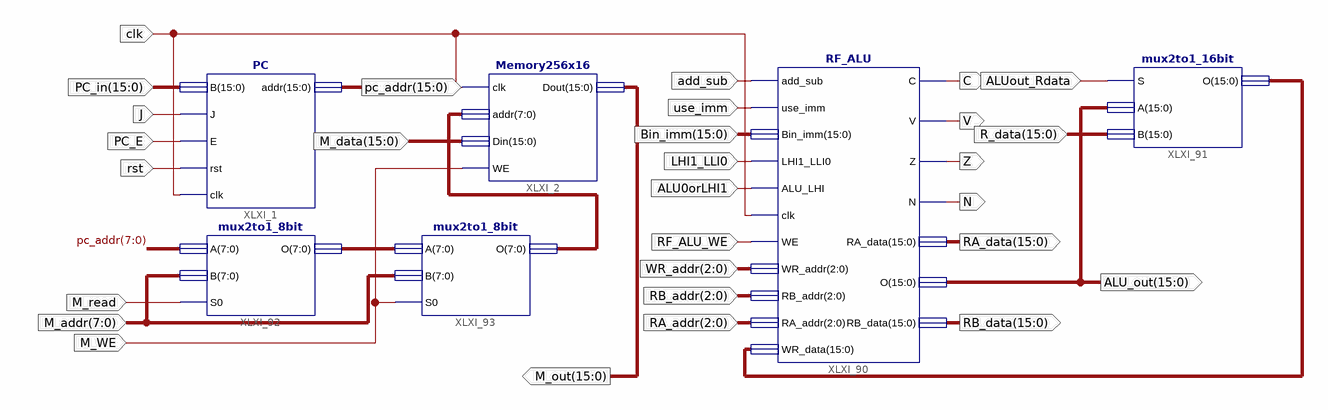
[diagram p0: schematic sheet 1]
// Xilinx ISE schematic datapath.sch (spartan6) as structural Verilog: 6 symbols, 29 ports
module datapath (
  input  J,
  input  PC_E,
  input  rst,
  input  [15:0] PC_in,
  input  RF_ALU_WE,
  input  [15:0] M_data,
  input  [15:0] Bin_imm,
  input  use_imm,
  input  add_sub,
  input  LHI1_LLI0,
  input  ALU0orLHI1,
  input  [2:0] WR_addr,
  input  [2:0] RB_addr,
  input  [2:0] RA_addr,
  input  clk,
  input  [7:0] M_addr,
  input  M_WE,
  input  M_read,
  input  [15:0] R_data,
  input  ALUout_Rdata,
  output C,
  output V,
  output Z,
  output N,
  output [15:0] pc_addr,
  output [15:0] M_out,
  output [15:0] ALU_out,
  output [15:0] RB_data,
  output [15:0] RA_data
);

  wire [7:0] XLXN_121, XLXN_218;
  wire [15:0] XLXN_27;

  RF_ALU XLXI_90 (
    .add_sub(add_sub), .use_imm(use_imm), .Bin_imm(Bin_imm), .LHI1_LLI0(LHI1_LLI0), .ALU_LHI(ALU0orLHI1),
    .clk(clk), .WE(RF_ALU_WE), .WR_addr(WR_addr), .RB_addr(RB_addr), .RA_addr(RA_addr), .WR_data(XLXN_27),
    .C(C), .V(V), .Z(Z), .N(N), .RA_data(RA_data), .O(ALU_out), .RB_data(RB_data));
  PC XLXI_1 (.B(PC_in), .J(J), .E(PC_E), .rst(rst), .clk(clk), .addr(pc_addr));
  Memory256x16 XLXI_2 (.clk(clk), .addr(XLXN_218), .Din(M_data), .WE(M_WE), .Dout(M_out));
  mux2to1_8bit XLXI_92 (.A(pc_addr[7:0]), .B(M_addr), .S0(M_read), .O(XLXN_121));
  mux2to1_8bit XLXI_93 (.A(XLXN_121), .B(M_addr), .S0(M_WE), .O(XLXN_218));
  mux2to1_16bit XLXI_91 (.S(ALUout_Rdata), .A(ALU_out), .B(R_data), .O(XLXN_27));
endmodule
